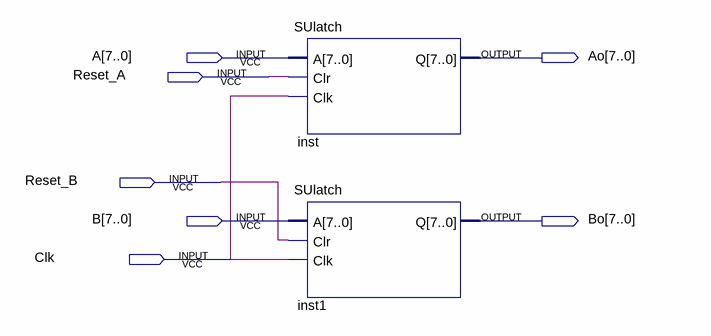
[diagram p0: schematic sheet]
// Quartus schematic StorageUnit.bdf as structural Verilog: 2 symbols, 7 pins
module StorageUnit (
  input  [7:0] A,
  input  Reset_A,
  input  Reset_B,
  input  [7:0] B,
  input  Clk,
  output [7:0] Ao,
  output [7:0] Bo
);

  SUlatch inst (.A(A), .Clr(Reset_A), .Clk(Clk), .Q(Ao));
  SUlatch inst1 (.A(B), .Clr(Reset_B), .Clk(Clk), .Q(Bo));
endmodule
